# Altium schematic sheet power.SchDoc: Opo
size Letter; Author: William Huang; Engineer: William Huang; Revision: 3.0
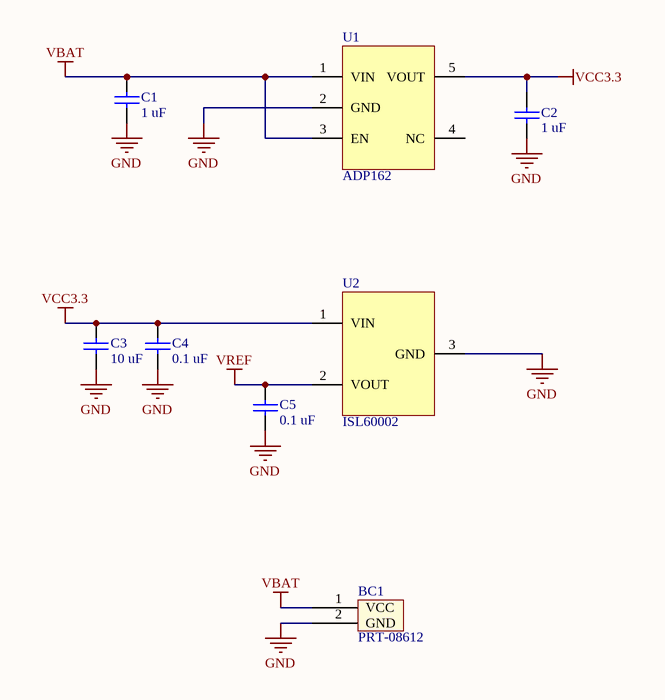
[diagram p0: power.SchDoc]

## Parts
BC1  PRT-08612  [JST PH 2PIN]
C1  value 1 uF  [0402]  (hidden comment: Ceramic capacitor)
C2  value 1 uF  [0402]  (hidden comment: Ceramic capacitor)
C3  value 10 uF  [0402]  (hidden comment: Ceramic capacitor)
C4  value 0.1 uF  [0402]  (hidden comment: Ceramic capacitor)
C5  value 0.1 uF  [0402]  (hidden comment: Ceramic capacitor)
U1  ADP162  [TSOT23-5]
U2  ISL60002  [SOT23-3N]

## Nets
GND: BC1.2(GND) C1.2 C2.2 C3.2 C4.2 C5.2 U1.2(GND) U2.3(GND)
VBAT: BC1.1(VCC) C1.1 U1.1(VIN) U1.3(EN)
VCC3.3: C2.1 C3.1 C4.1 U1.5(VOUT) U2.1(VIN)
VREF: C5.1 U2.2(VOUT)

Not connected (* = marked no-connect by the designer): BC1 3 4; U1 4(NC)

## Notes on the sheet
- Title
- Date:
- Author:
- Revision:
- Sheet
- of
- University of Michigan
- File:

## Library data of the parts
BC1 = JST-PH-2mm-2Pin: 2-pin JST-PH 2mm Battery Connector; Supplier 1: Sparkfun; Supplier Part Number 1: PRT-08612
C1 C2 = C_1u_0402_ceramic: Ceramic capacitor, 1 uF, 0402 package; Manufacture: TDK; voltage rated: 6.3 V; tolerance: 10%; package: 0402; Supplier 1: Digi-Key; Supplier Part Number 1: 445-5000-1-ND
C3 = C_10u_0402_ceramic: Ceramic capacitor, 10 uF, 0402 package; Manufacture: TDK; voltage rated: 4V; tolerance: 20%; package: 0402; Supplier 1: Digi-Key; Supplier Part Number 1: 445-8919-1-ND
C4 C5 = C_0.1u_0402_ceramic: Ceramic capacitor, 0.1u, 0402 package; Manufacture: TDK; voltage rated: 10 V; tolerance: 10%; Supplier 1: Digi-Key; Supplier Part Number 1: 445-1265-1-ND; package: 0402
U1 = ADP162: IC REG LDO 3.3V 0.15A TSOT23-5; Supplier 1: Digi-Key; Supplier Part Number 1: ADP162AUJZ-3.3-R7CT-ND
U2 = ISL60002: IC VREF SERIES PREC SOT-23-3; Supplier 1: Digi-Key; Supplier Part Number 1: ISL60002DIH310Z-TKCT-ND